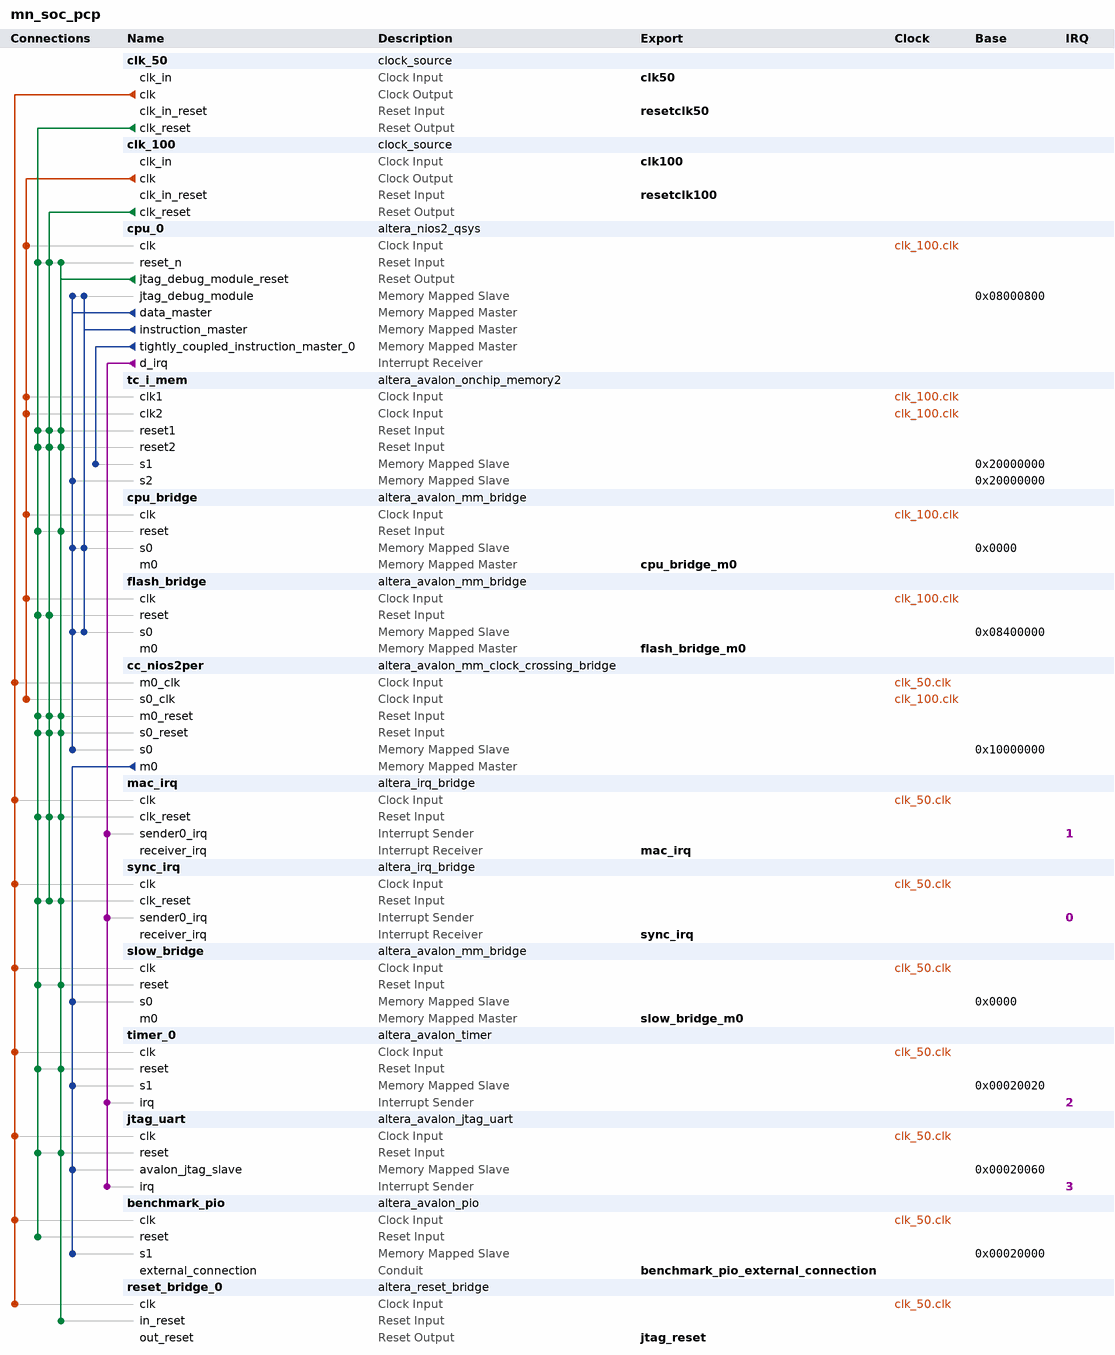
[diagram p0: system contents]
# Platform Designer (Qsys) system mn_soc_pcp, Cyclone V 5CSXFC6D6F31C6
# Parameters at their usual value, and those the tool derives, are not listed.
package require -exact qsys 14.0
create_system mn_soc_pcp
set_project_property DEVICE_FAMILY {Cyclone V}
set_project_property DEVICE 5CSXFC6D6F31C6

add_instance clk_50 clock_source 14.0
set_instance_parameter_value clk_50 clockFrequency 50000000

add_instance clk_100 clock_source 14.0
set_instance_parameter_value clk_100 clockFrequency 100000000

add_instance cpu_0 altera_nios2_qsys 14.0
set_instance_parameter_value cpu_0 mmu_autoAssignTlbPtrSz false
set_instance_parameter_value cpu_0 resetrequest_enabled true
set_instance_parameter_value cpu_0 resetOffset 138412032
set_instance_parameter_value cpu_0 cpuID 2
set_instance_parameter_value cpu_0 resetSlave Absolute
set_instance_parameter_value cpu_0 mmu_TLBMissExcSlave tc_i_m.s1
set_instance_parameter_value cpu_0 exceptionSlave tc_i_mem.s1
set_instance_parameter_value cpu_0 breakSlave cpu_0.jtag_debug_module
set_instance_parameter_value cpu_0 impl Fast
set_instance_parameter_value cpu_0 icache_size 32768
set_instance_parameter_value cpu_0 icache_numTCIM 1
set_instance_parameter_value cpu_0 dcache_size 32768

add_instance tc_i_mem altera_avalon_onchip_memory2 14.0
set_instance_parameter_value tc_i_mem dataWidth 32
set_instance_parameter_value tc_i_mem dualPort true
set_instance_parameter_value tc_i_mem initMemContent true
set_instance_parameter_value tc_i_mem initializationFileName onchip_mem.hex
set_instance_parameter_value tc_i_mem memorySize 20000

add_instance cpu_bridge altera_avalon_mm_bridge 14.0
set_instance_parameter_value cpu_bridge DATA_WIDTH 32
set_instance_parameter_value cpu_bridge ADDRESS_WIDTH 27
set_instance_parameter_value cpu_bridge USE_AUTO_ADDRESS_WIDTH 0
set_instance_parameter_value cpu_bridge ADDRESS_UNITS SYMBOLS
set_instance_parameter_value cpu_bridge MAX_BURST_SIZE 8
set_instance_parameter_value cpu_bridge MAX_PENDING_RESPONSES 4

add_instance flash_bridge altera_avalon_mm_bridge 14.0
set_instance_parameter_value flash_bridge DATA_WIDTH 32
set_instance_parameter_value flash_bridge ADDRESS_WIDTH 22
set_instance_parameter_value flash_bridge USE_AUTO_ADDRESS_WIDTH 0
set_instance_parameter_value flash_bridge ADDRESS_UNITS SYMBOLS
set_instance_parameter_value flash_bridge MAX_BURST_SIZE 8
set_instance_parameter_value flash_bridge MAX_PENDING_RESPONSES 4

add_instance cc_nios2per altera_avalon_mm_clock_crossing_bridge 14.0
set_instance_parameter_value cc_nios2per DATA_WIDTH 32
set_instance_parameter_value cc_nios2per ADDRESS_WIDTH 20
set_instance_parameter_value cc_nios2per USE_AUTO_ADDRESS_WIDTH 0
set_instance_parameter_value cc_nios2per MAX_BURST_SIZE 1
set_instance_parameter_value cc_nios2per COMMAND_FIFO_DEPTH 4
set_instance_parameter_value cc_nios2per RESPONSE_FIFO_DEPTH 4
set_instance_parameter_value cc_nios2per MASTER_SYNC_DEPTH 2
set_instance_parameter_value cc_nios2per SLAVE_SYNC_DEPTH 2

add_instance mac_irq altera_irq_bridge 14.0
set_instance_parameter_value mac_irq IRQ_WIDTH 1

add_instance sync_irq altera_irq_bridge 14.0
set_instance_parameter_value sync_irq IRQ_WIDTH 1

add_instance slow_bridge altera_avalon_mm_bridge 14.0
set_instance_parameter_value slow_bridge DATA_WIDTH 32
set_instance_parameter_value slow_bridge ADDRESS_WIDTH 17
set_instance_parameter_value slow_bridge USE_AUTO_ADDRESS_WIDTH 0
set_instance_parameter_value slow_bridge ADDRESS_UNITS SYMBOLS
set_instance_parameter_value slow_bridge MAX_PENDING_RESPONSES 4

add_instance timer_0 altera_avalon_timer 14.0
set_instance_parameter_value timer_0 period 1
set_instance_parameter_value timer_0 periodUnits MSEC

add_instance jtag_uart altera_avalon_jtag_uart 14.0
set_instance_parameter_value jtag_uart simInteractiveOptions INTERACTIVE_ASCII_OUTPUT

add_instance benchmark_pio altera_avalon_pio 14.0
set_instance_parameter_value benchmark_pio bitModifyingOutReg true
set_instance_parameter_value benchmark_pio direction Output
set_instance_parameter_value benchmark_pio width 8

add_instance reset_bridge_0 altera_reset_bridge 14.0
set_instance_parameter_value reset_bridge_0 ACTIVE_LOW_RESET 1
set_instance_parameter_value reset_bridge_0 SYNCHRONOUS_EDGES deassert

# connections
add_connection clk_50.clk benchmark_pio.clk clock
add_connection clk_50.clk cc_nios2per.m0_clk clock
add_connection clk_50.clk jtag_uart.clk clock
add_connection clk_50.clk mac_irq.clk clock
add_connection clk_50.clk reset_bridge_0.clk clock
add_connection clk_50.clk slow_bridge.clk clock
add_connection clk_50.clk sync_irq.clk clock
add_connection clk_50.clk timer_0.clk clock
add_connection clk_100.clk cc_nios2per.s0_clk clock
add_connection clk_100.clk cpu_0.clk clock
add_connection clk_100.clk cpu_bridge.clk clock
add_connection clk_100.clk flash_bridge.clk clock
add_connection clk_100.clk tc_i_mem.clk1 clock
add_connection clk_100.clk tc_i_mem.clk2 clock
add_connection clk_50.clk_reset benchmark_pio.reset reset
add_connection clk_50.clk_reset cc_nios2per.m0_reset reset
add_connection clk_50.clk_reset cc_nios2per.s0_reset reset
add_connection clk_50.clk_reset cpu_0.reset_n reset
add_connection clk_50.clk_reset cpu_bridge.reset reset
add_connection clk_50.clk_reset flash_bridge.reset reset
add_connection clk_50.clk_reset jtag_uart.reset reset
add_connection clk_50.clk_reset mac_irq.clk_reset reset
add_connection clk_50.clk_reset slow_bridge.reset reset
add_connection clk_50.clk_reset sync_irq.clk_reset reset
add_connection clk_50.clk_reset tc_i_mem.reset1 reset
add_connection clk_50.clk_reset tc_i_mem.reset2 reset
add_connection clk_50.clk_reset timer_0.reset reset
add_connection clk_100.clk_reset cc_nios2per.m0_reset reset
add_connection clk_100.clk_reset cc_nios2per.s0_reset reset
add_connection clk_100.clk_reset cpu_0.reset_n reset
add_connection clk_100.clk_reset flash_bridge.reset reset
add_connection clk_100.clk_reset mac_irq.clk_reset reset
add_connection clk_100.clk_reset sync_irq.clk_reset reset
add_connection clk_100.clk_reset tc_i_mem.reset1 reset
add_connection clk_100.clk_reset tc_i_mem.reset2 reset
add_connection cpu_0.jtag_debug_module_reset cc_nios2per.m0_reset reset
add_connection cpu_0.jtag_debug_module_reset cc_nios2per.s0_reset reset
add_connection cpu_0.jtag_debug_module_reset cpu_0.reset_n reset
add_connection cpu_0.jtag_debug_module_reset cpu_bridge.reset reset
add_connection cpu_0.jtag_debug_module_reset jtag_uart.reset reset
add_connection cpu_0.jtag_debug_module_reset mac_irq.clk_reset reset
add_connection cpu_0.jtag_debug_module_reset reset_bridge_0.in_reset reset
add_connection cpu_0.jtag_debug_module_reset slow_bridge.reset reset
add_connection cpu_0.jtag_debug_module_reset sync_irq.clk_reset reset
add_connection cpu_0.jtag_debug_module_reset tc_i_mem.reset1 reset
add_connection cpu_0.jtag_debug_module_reset tc_i_mem.reset2 reset
add_connection cpu_0.jtag_debug_module_reset timer_0.reset reset
add_connection cc_nios2per.m0 benchmark_pio.s1 avalon
set_connection_parameter_value cc_nios2per.m0/benchmark_pio.s1 baseAddress 0x00020000
add_connection cc_nios2per.m0 jtag_uart.avalon_jtag_slave avalon
set_connection_parameter_value cc_nios2per.m0/jtag_uart.avalon_jtag_slave baseAddress 0x00020060
add_connection cc_nios2per.m0 slow_bridge.s0 avalon
set_connection_parameter_value cc_nios2per.m0/slow_bridge.s0 baseAddress 0x0000
add_connection cc_nios2per.m0 timer_0.s1 avalon
set_connection_parameter_value cc_nios2per.m0/timer_0.s1 baseAddress 0x00020020
add_connection cpu_0.data_master cc_nios2per.s0 avalon
set_connection_parameter_value cpu_0.data_master/cc_nios2per.s0 baseAddress 0x10000000
add_connection cpu_0.data_master cpu_0.jtag_debug_module avalon
set_connection_parameter_value cpu_0.data_master/cpu_0.jtag_debug_module baseAddress 0x08000800
add_connection cpu_0.data_master cpu_bridge.s0 avalon
set_connection_parameter_value cpu_0.data_master/cpu_bridge.s0 baseAddress 0x0000
add_connection cpu_0.data_master flash_bridge.s0 avalon
set_connection_parameter_value cpu_0.data_master/flash_bridge.s0 baseAddress 0x08400000
add_connection cpu_0.data_master tc_i_mem.s2 avalon
set_connection_parameter_value cpu_0.data_master/tc_i_mem.s2 baseAddress 0x20000000
add_connection cpu_0.instruction_master cpu_0.jtag_debug_module avalon
set_connection_parameter_value cpu_0.instruction_master/cpu_0.jtag_debug_module baseAddress 0x08000800
add_connection cpu_0.instruction_master cpu_bridge.s0 avalon
set_connection_parameter_value cpu_0.instruction_master/cpu_bridge.s0 baseAddress 0x0000
add_connection cpu_0.instruction_master flash_bridge.s0 avalon
set_connection_parameter_value cpu_0.instruction_master/flash_bridge.s0 baseAddress 0x08400000
add_connection cpu_0.tightly_coupled_instruction_master_0 tc_i_mem.s1 avalon
set_connection_parameter_value cpu_0.tightly_coupled_instruction_master_0/tc_i_mem.s1 baseAddress 0x20000000
add_connection cpu_0.d_irq jtag_uart.irq interrupt
set_connection_parameter_value cpu_0.d_irq/jtag_uart.irq irqNumber 3
add_connection cpu_0.d_irq mac_irq.sender0_irq interrupt
set_connection_parameter_value cpu_0.d_irq/mac_irq.sender0_irq irqNumber 1
add_connection cpu_0.d_irq sync_irq.sender0_irq interrupt
set_connection_parameter_value cpu_0.d_irq/sync_irq.sender0_irq irqNumber 0
add_connection cpu_0.d_irq timer_0.irq interrupt
set_connection_parameter_value cpu_0.d_irq/timer_0.irq irqNumber 2

# exported interfaces
add_interface clk50 clock sink
set_interface_property clk50 EXPORT_OF clk_50.clk_in
add_interface resetclk50 reset sink
set_interface_property resetclk50 EXPORT_OF clk_50.clk_in_reset
add_interface benchmark_pio_external_connection conduit end
set_interface_property benchmark_pio_external_connection EXPORT_OF benchmark_pio.external_connection
add_interface clk100 clock sink
set_interface_property clk100 EXPORT_OF clk_100.clk_in
add_interface cpu_bridge_m0 avalon master
set_interface_property cpu_bridge_m0 EXPORT_OF cpu_bridge.m0
add_interface resetclk100 reset sink
set_interface_property resetclk100 EXPORT_OF clk_100.clk_in_reset
add_interface slow_bridge_m0 avalon master
set_interface_property slow_bridge_m0 EXPORT_OF slow_bridge.m0
add_interface mac_irq interrupt receiver
set_interface_property mac_irq EXPORT_OF mac_irq.receiver_irq
add_interface sync_irq interrupt receiver
set_interface_property sync_irq EXPORT_OF sync_irq.receiver_irq
add_interface flash_bridge_m0 avalon master
set_interface_property flash_bridge_m0 EXPORT_OF flash_bridge.m0
add_interface jtag_reset reset source
set_interface_property jtag_reset EXPORT_OF reset_bridge_0.out_reset

set_interconnect_requirement {$system} qsys_mm.clockCrossingAdapter HANDSHAKE
set_interconnect_requirement {$system} qsys_mm.maxAdditionalLatency 1
set_interconnect_requirement {$system} qsys_mm.insertDefaultSlave false

save_system mn_soc_pcp.qsys
